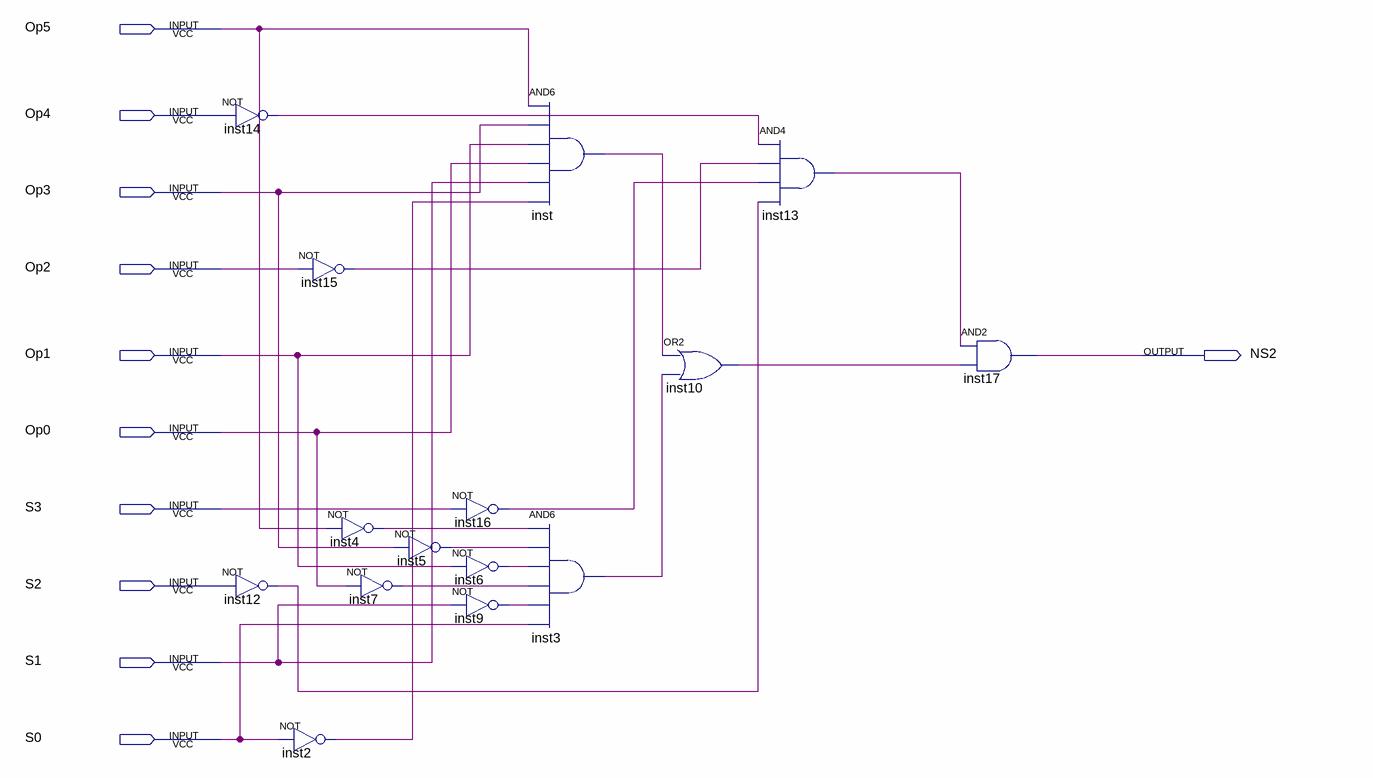
[diagram p0: schematic sheet]
// Quartus schematic NS2.bdf as structural Verilog: 15 symbols, 11 pins
module NS2 (
  input  Op5,
  input  Op4,
  input  Op3,
  input  Op2,
  input  Op1,
  input  Op0,
  input  S3,
  input  S2,
  input  S1,
  input  S0,
  output NS2
);

  wire inst2_out, inst3_out, inst4_out, inst5_out, inst6_out, inst7_out, inst9_out, inst10_out, inst12_out,
       inst13_out, inst14_out, inst15_out, inst16_out, inst_out;

  not inst14 (inst14_out, Op4);
  not inst12 (inst12_out, S2);
  not inst15 (inst15_out, Op2);
  not inst2 (inst2_out, S0);
  not inst4 (inst4_out, Op5);
  not inst7 (inst7_out, Op0);
  not inst16 (inst16_out, S3);
  not inst5 (inst5_out, Op3);
  not inst6 (inst6_out, Op1);
  not inst9 (inst9_out, S1);
  and inst (inst_out, Op5, Op3, Op1, Op0, S1, inst2_out);
  and inst3 (inst3_out, inst4_out, inst5_out, inst6_out, inst7_out, inst9_out, S0);
  or inst10 (inst10_out, inst_out, inst3_out);
  and inst13 (inst13_out, inst14_out, inst15_out, inst16_out, inst12_out);
  and inst17 (NS2, inst13_out, inst10_out);
endmodule
